# Altium schematic sheet TOP.SchDoc: Bat Charger Top
size A3; CompanyName: WHE; DrawnBy: ahorat / daniw; Engineer: ahorat / daniw; SheetNumber: 1; SheetTotal: 3
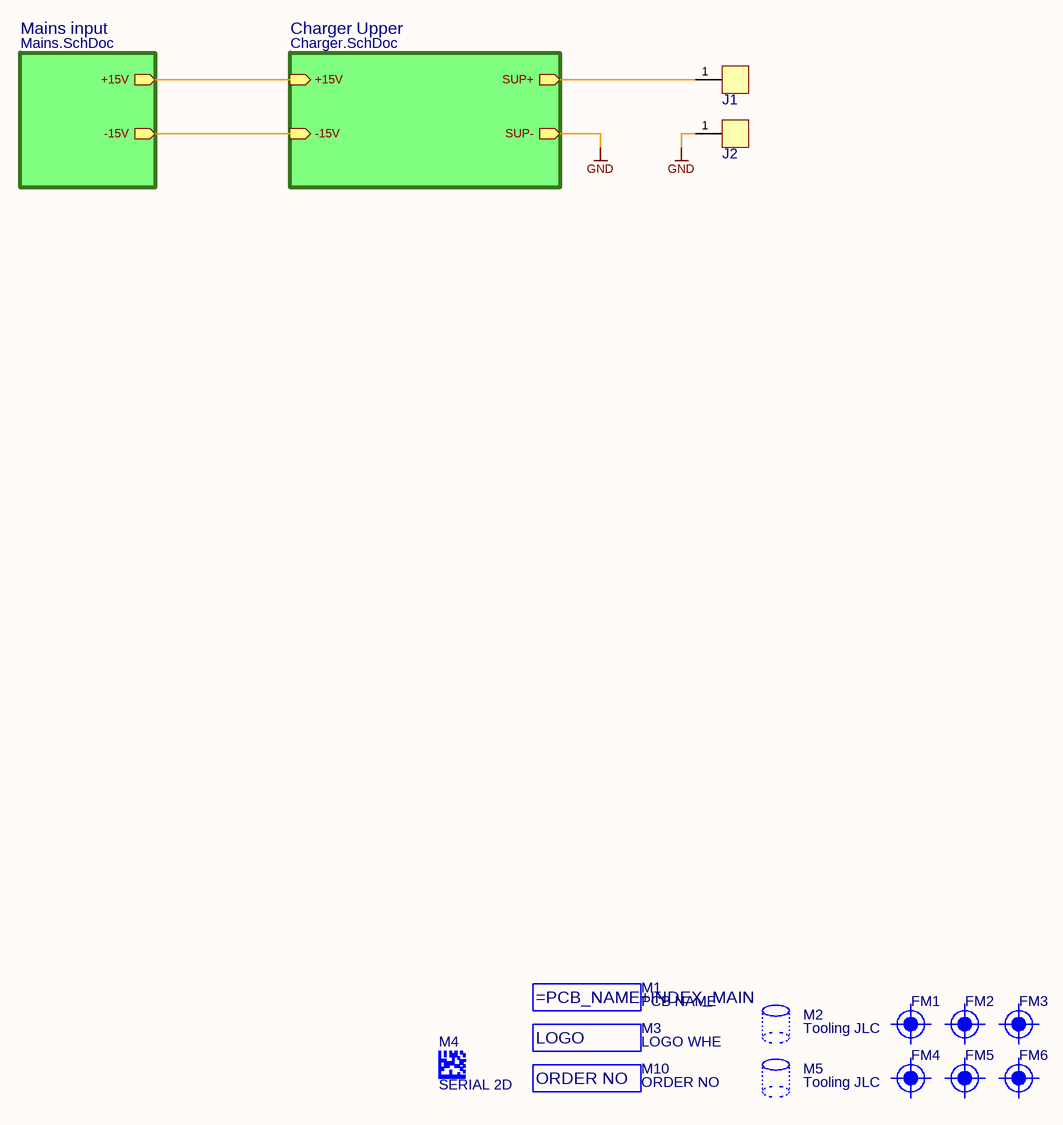
[diagram p0: TOP.SchDoc]

## Parts
FM1  Fidu_1mm  [FIDU-1MM]  (value not drawn)  (no BOM)
FM2  Fidu_1mm  [FIDU-1MM]  (value not drawn)  (no BOM)
FM3  Fidu_1mm  [FIDU-1MM]  (value not drawn)  (no BOM)
FM4  Fidu_1mm  [FIDU-1MM]  (value not drawn)  (no BOM)
FM5  Fidu_1mm  [FIDU-1MM]  (value not drawn)  (no BOM)
FM6  Fidu_1mm  [FIDU-1MM]  (value not drawn)  (no BOM)
J1  6.35mmx0.81mm Tab THT  [Tab_THT_635]  (value not drawn)
J2  6.35mmx0.81mm Tab THT  [Tab_THT_635]  (value not drawn)
M1  PCB NAME  [PCB-NAME-5MM-LEFT]
M2  Tooling JLC  [TOOLING-JLC]
M3  LOGO WHE  [LOGO-WHE-5MM]
M4  SERIAL 2D  [SERIAL-2D-8MM-RESTRICT]
M5  Tooling JLC  [TOOLING-JLC]
M10  ORDER NO  [JLC-ORDER]  (graphical)

## Sub-sheets
Charger Upper = Charger.SchDoc: +15V (in), -15V (in), SUP+ (out), SUP- (out)
Mains input = Mains.SchDoc: +15V (out), -15V (out)

## Nets
GND: J2.1 ; sheet Charger Upper/SUP-
NetJ1_1: J1.1 ; sheet Charger Upper/SUP+
(unnamed): sheet Charger Upper/+15V, sheet Mains input/+15V
(unnamed): sheet Charger Upper/-15V, sheet Mains input/-15V

## Notes on the sheet
- Date:
- Size:
- A3
- Schema:
- Layout:

## Library data of the parts
FM1-FM6 = Fidu_1mm: Fiducial 1mm; Manufacturer: NONE; Part Number: Fidu_1mm
J1 J2 = Tab_025_THT: CONN QC TAB 0.250 SOLDER; Manufacturer: GENERIC; Manufacturer 1: TE Connectivity AMP Connectors; Manufacturer Part Number 1: 1217861-1; Part Number: Tab_025_THT; HelpURL: https://www.te.com/usa-en/product-1217861-1.datasheet.pdf; Supplier 1: Digi-Key; Supplier Part Number 1: A100452CT-ND; Manufacturer 3: TE Connectivity; Manufacturer Part Number 3: 1217861-1; Supplier 3: LCSC; Supplier Part Number 3: C428480
M1 = PCB NAME 5mm L: PCB name, 5mm text height, left-aligned; Manufacturer: NONE; Part Number: PCB NAME 5mm L
M2 M5 = Tooling JLC: Tooling hole for JLC (1.152mm); Manufacturer: NONE; Part Number: Tooling JLC
M3 = LOGO WHE 5MM: WHE logo, size 5mm; Manufacturer: NONE; Part Number: LOGO WHE 5MM
M4 = SERIAL 2D 8MM RESTRICT: 2D Serial number placeholder, Dotmatrix or QR, size: 8mm, restriction on top layer; Manufacturer: NONE; Part Number: SERIAL 2D 8MM RESTRICT
M10 = ORDER NO JLC: Order number, JLC as per requirement; Manufacturer: NONE; Part Number: ORDER NO JLC